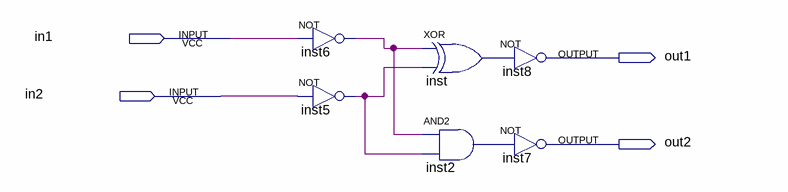
[diagram p0: schematic sheet]
// Quartus schematic practice1.bdf as structural Verilog: 6 symbols, 4 pins
module practice1 (
  input  in1,
  input  in2,
  output out1,
  output out2
);

  wire inst2_out, inst5_out, inst6_out, inst_out;

  not inst6 (inst6_out, in1);
  not inst5 (inst5_out, in2);
  xor inst (inst_out, inst6_out, inst5_out);
  and inst2 (inst2_out, inst6_out, inst5_out);
  not inst8 (out1, inst_out);
  not inst7 (out2, inst2_out);
endmodule
